# EAGLE design photon_rj45 (EAGLE 8.5.0)
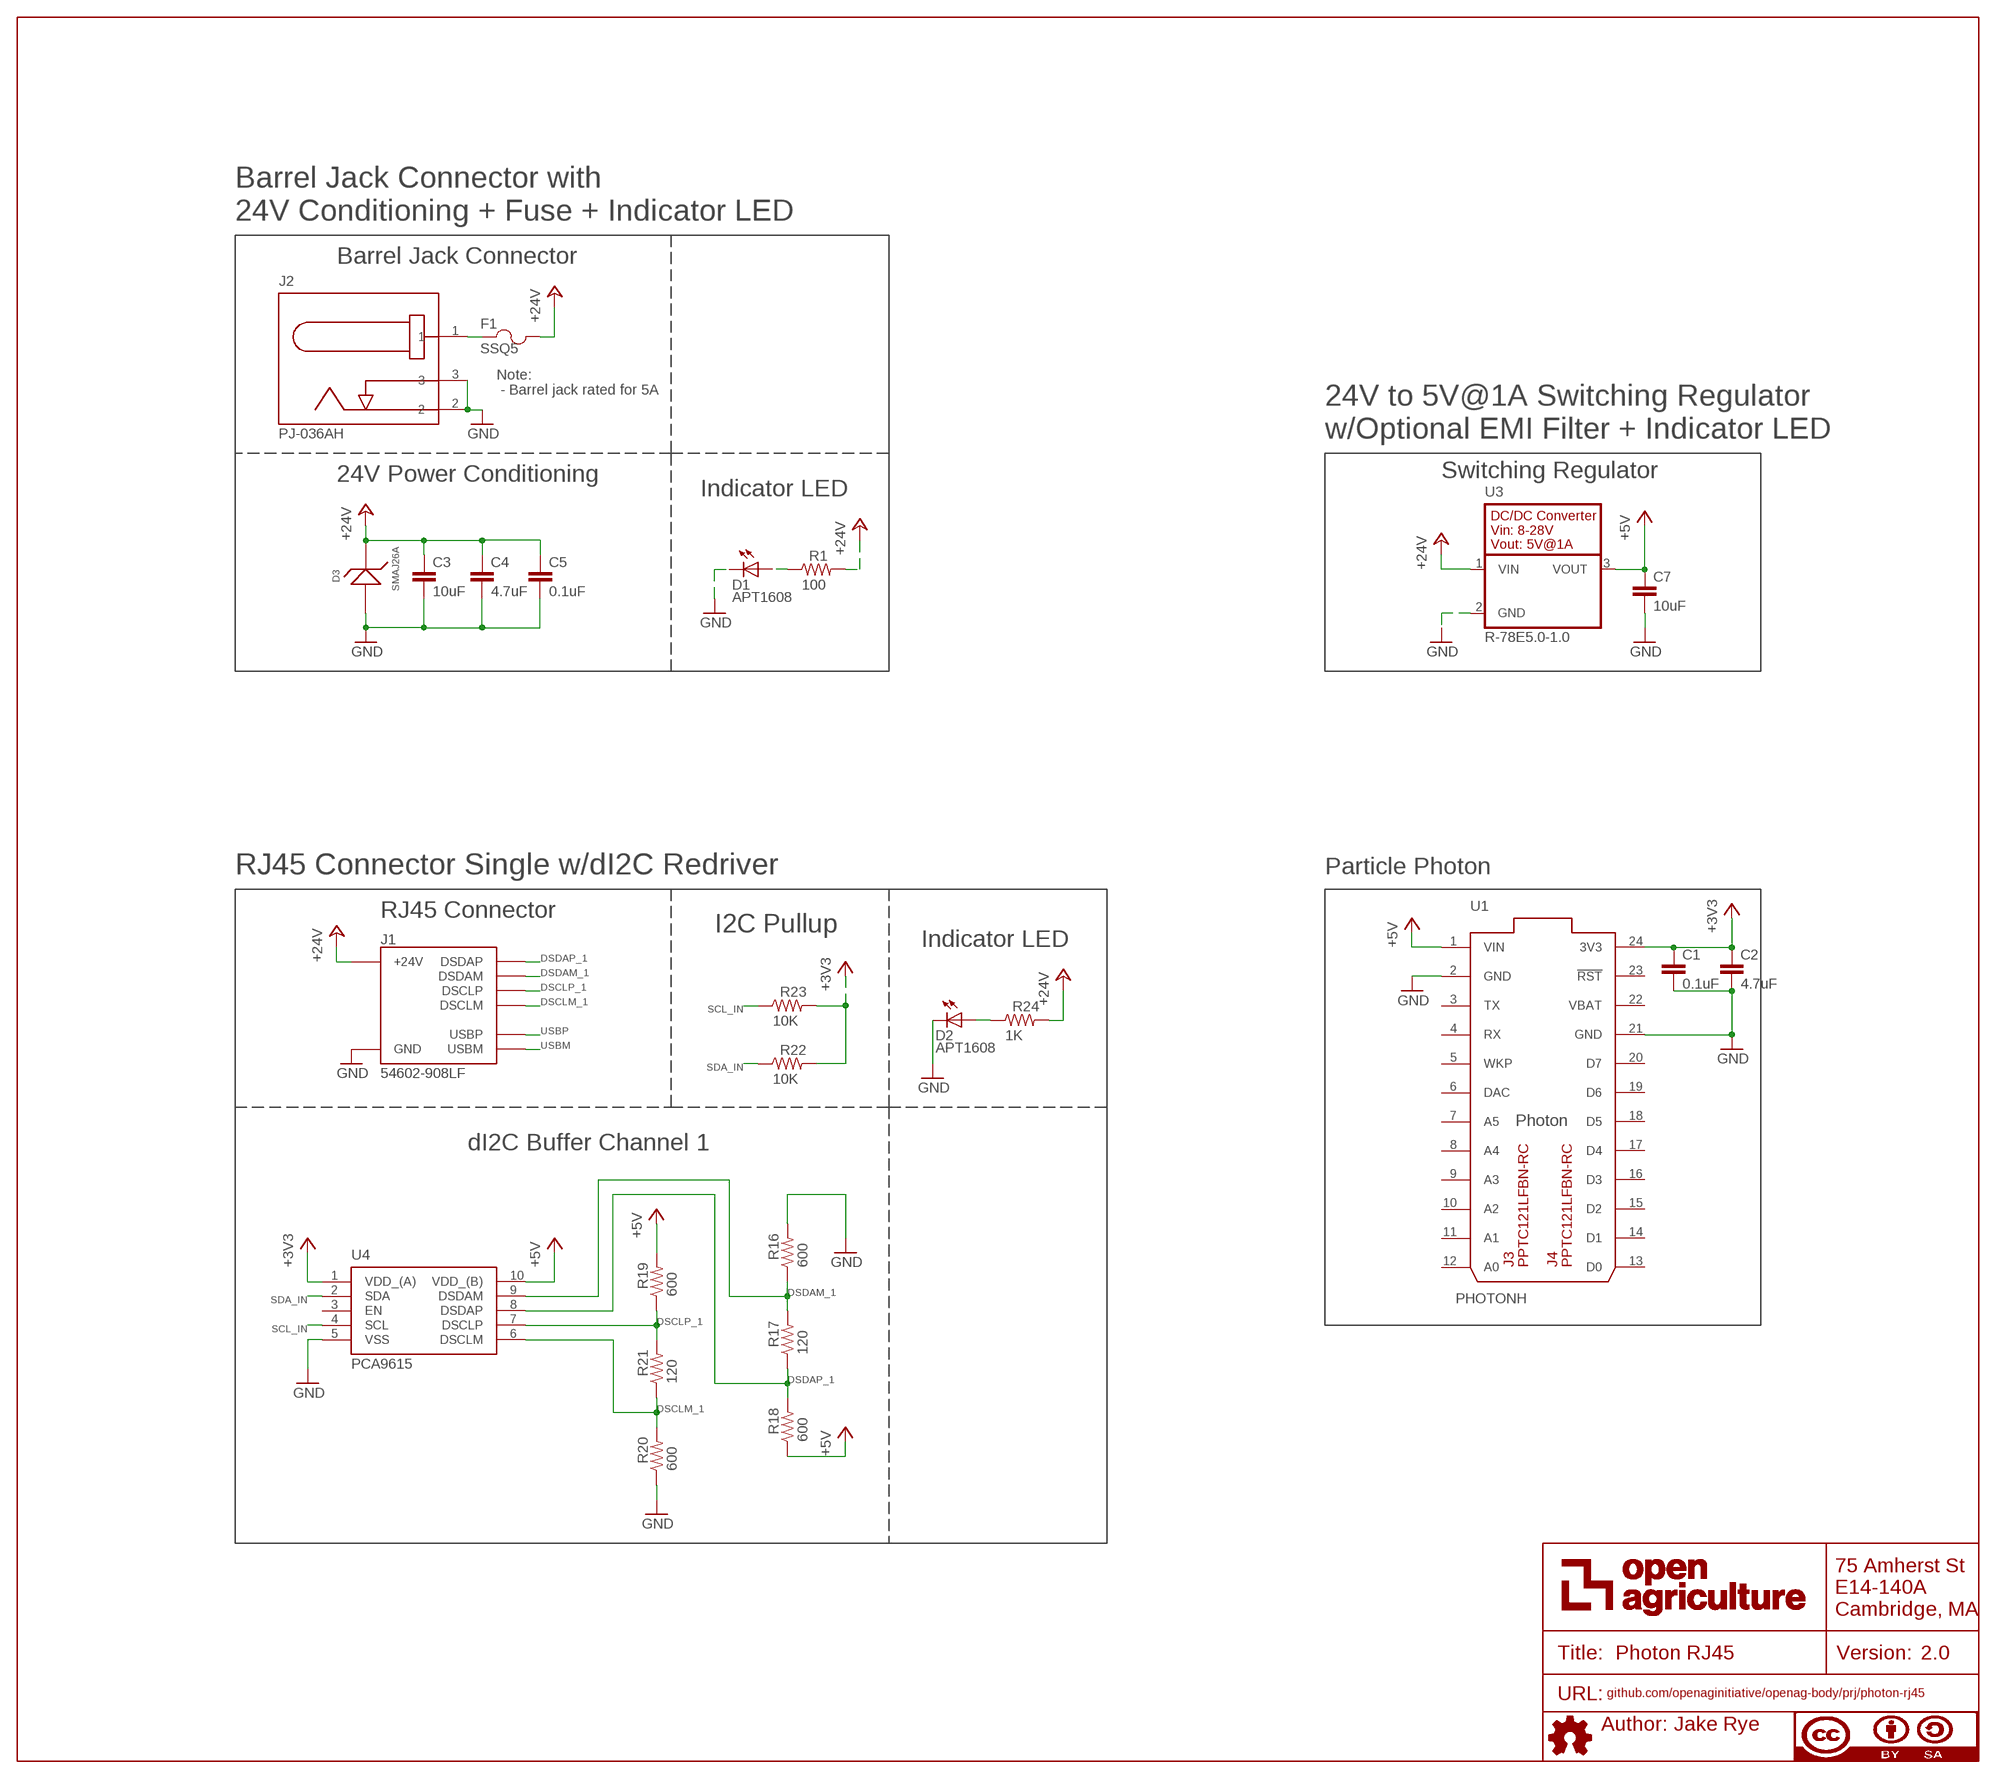
[diagram p0: schematic, sheet 1]
U$2 (DOCFIELD-SCHEMATIC-ONLY): AUTHOR: Jake Rye; MPN: N/A; TITLE: Photon RJ45; URL: github.com/openaginitiative/openag-body/prj/photon-rj45; VER: 2.0

## Parts
C1  0.1uF  0.1UF-C0603C104K5RACTU  [C0603]
C2  4.7uF  4.7UF-CL21A475KBQNNNE  [C0805]
C3  10uF  10UF-GMK212BBJ106KG-T  [C0805]
C4  4.7uF  4.7UF-CL21A475KBQNNNE  [C0805]
C5  0.1uF  0.1UF-C0603C104K5RACTU  [C0603]
C7  10uF  10UF-GMK212BBJ106KG-T  [C0805]
D1  APT1608  APT1608CGCK  [CHIPLED_0603]
D2  APT1608  APT1608CGCK  [CHIPLED_0603]
D3  SMAJ26A  SMAJ26A-13-F  [SMA]
F1  SSQ5  [SS]
J1  54602-908LF  RJ45-DI2C-USB-54602-908LFPTH  [RJ45-DI2C-USB-54602-908LF]
J2  PJ-036AH  BARREL-JACK-PJ-036AH-SMT-TR  [BARREL-JACK-PJ-036AH]
J3  PPTC121LFBN-RC  HEADER-1X12-FEMALE-PPTC121LFBN-RC-BOM-ONLY  [NAME-VALUE-ONLY]
J4  PPTC121LFBN-RC  HEADER-1X12-FEMALE-PPTC121LFBN-RC-BOM-ONLY  [NAME-VALUE-ONLY]
R1  100  100OHM-RC0603JR-07100RL  [RC0603N]
R16  600  600OHM-RC0603FR-07604RL  [RC0603N]
R17  120  120OHM-RC0603FR-07120RL  [RC0603N]
R18  600  600OHM-RC0603FR-07604RL  [RC0603N]
R19  600  600OHM-RC0603FR-07604RL  [RC0603N]
R20  600  600OHM-RC0603FR-07604RL  [RC0603N]
R21  120  120OHM-RC0603FR-07120RL  [RC0603N]
R22  10K  10K-ERJ-3EKF1002V  [RC0603N]
R23  10K  10K-ERJ-3EKF1002V  [RC0603N]
R24  1K  1K-ERJ-PB3D1001V  [RC0603N]
U1  PHOTONH  PHOTONH-NO-BOTTOM-LABEL  [PHOTON-NO-BOTTOM-LABELS]
U3  R-78E5.0-1.0  [R-78E5.0-1.0]
U4  PCA9615  PCA9615DPJ  [SOP50P490X110-10N]

## Nets
24V_IN1: F1.1 J2.1
+3V3: C1.1 C2.1 R22.2 R23.2 U1.24(3V3) U4.1(VDD_(A))
+5V: C7.1 R18.1 R19.2 U1.1(VIN) U3.3(VOUT) U4.10(VDD_(B))
+24V: C3.1 C4.1 C5.1 D3.1 F1.2 J1.24V(6)(+24V) R1.2 R24.2 U3.1(VIN)
DSCLM_1: J1.DSCLM(5)(DSCLM) R20.2 R21.1 U4.6(DSCLM)
DSCLP_1: J1.DSCLP(4)(DSCLP) R19.1 R21.2 U4.7(DSCLP)
DSDAM_1: J1.DSDAM(2)(DSDAM) R16.1 R17.2 U4.9(DSDAM)
DSDAP_1: J1.DSDAP(1)(DSDAP) R17.1 R18.2 U4.8(DSDAP)
GND: C1.2 C2.2 C3.2 C4.2 C5.2 C7.2 D1.C D2.C D3.2 J1.GND(3)(GND) J2.2 J2.3 R16.2 R20.1 U1.2(GND) U1.21(GND) U3.2(GND) U4.5(VSS)
N$5: D2.A R24.1
N$6: D1.A R1.1
SCL_IN: R23.1 U4.4(SCL)
SDA_IN: R22.1 U4.2(SDA)
USBM: J1.USBM(8)(USBM)
USBP: J1.USBP(7)(USBP)
Unconnected: U1.3(TX) U1.4(RX) U1.5(WKP) U1.6(DAC) U1.7(A5) U1.8(A4) U1.9(A3) U1.10(A2) U1.11(A1) U1.12(A0) U1.13(D0) U1.14(D1) U1.15(D2) U1.16(D3) U1.17(D4) U1.18(D5) U1.19(D6) U1.20(D7) U1.23(!RST) U4.3(EN)

## Notes on the sheet
- Barrel Jack Connector with
  24V Conditioning + Fuse + Indicator LED
- Barrel Jack Connector
- Note:
   - Barrel jack rated for 5A
- 24V to 5V@1A Switching Regulator
  w/Optional EMI Filter + Indicator LED
- 24V Power Conditioning | Switching Regulator
- Indicator LED
- RJ45 Connector Single w/dI2C Redriver | Particle Photon
- RJ45 Connector
- I2C Pullup
- Indicator LED
- dI2C Buffer Channel 1

## Power pins joined to a net without a drawn wire
VBAT: U1.22(VBAT)

## Library data of the parts
C1 C5 = openag-capacitors:0.1UF-C0603C104K5RACTU: CAP CER 0.1UF 50V X7R 0603 Description: 0.1µF ±10% 50V Ceramic Capacitor X7R 0603 (1608 Metric) Technical Specifications: Capacitance: 0.1µF Tolerance: ±10% Rated Voltage: 50V Temperature Coefficient: X7R Operating Temperature: -55°C ~ 125°C Package / Case: 0603 (1608 Metric) Datasheet(s): X7R Dielectric, 6.3-250 VDC <https://search.kemet.com/component-edge/download/datasheet/C0603C104K5RACTU.pdf> Vendor(s): Digikey: 399-5089-1-ND <https://www.digikey.com/product-detail/en/kemet/C0603C104K5RACTU/399-5089-1-ND/1465623>; MANUFACTURER: Kemet; MPN: C0603C104K5RACTU; VENDOR: Digikey; VLINK: https://www.digikey.com/product-detail/en/kemet/C0603C104K5RACTU/399-5089-1-ND/1465623; VPN: 399-5089-1-ND
C2 C4 = openag-capacitors:4.7UF-CL21A475KBQNNNE: CAP CER 4.7UF 50V X5R 0805 Description: 4.7µF ±10% 50V Ceramic Capacitor X5R 0805 (2012 Metric) Technical Specifications: Capacitance: 4.7uF Tolerance: ±10% Rated Voltage: 50V Temperature Coefficient: X5R Operating Temperature: -55°C ~ 85°C Package/Case: 0805 (2012 Metric) Datasheet(s): CL21A475KBQNNNE Characteristics <http://www.samsungsem.com/kr/front/downloadcms.do?path=/kr/support/product-search/mlcc/__icsFiles/afieldfile/2014/11/05&fileName=C_CL21A475KBQNNNE.pdf> Vendor(s): Digikey: 1276-1248-1-ND <https://www.digikey.com/product-detail/en/samsung-electro-mechanics/CL21A475KBQNNNE/1276-1248-1-ND/3889334>; MANUFACTURER: Samsung; MPN: CL21A475KBQNNNE; VENDOR: Digikey; VLINK: https://www.digikey.com/product-detail/en/samsung-electro-mechanics/CL21A475KBQNNNE/1276-1248-1-ND/3889334; VPN: 1276-1248-1-ND
C3 C7 = openag-capacitors:10UF-GMK212BBJ106KG-T: CAP CER 10UF 35V X5R 0805 Description: 10µF ±10% 35V Ceramic Capacitor X5R 0805 (2012 Metric) Technical Specifications: Capacitance: 10µF Tolerance: ±10% Rated Voltage: 35V Temperature Coefficient: X5R Operating Temperature: -55°C ~ 85°C Package / Case: 0805 (2012 Metric) Datasheet(s): GMK212BBJ106KG-T Spec <http://ds.yuden.co.jp/TYCOMPAS/ut/detail.do?productNo=GMK212BBJ106KG-T&fileName=GMK212BBJ106KG-T_SS&mode=specSheetDownload> Vendor(s): Digikey: 587-4893-1-ND <https://www.digikey.com/product-detail/en/taiyo-yuden/GMK212BBJ106KG-T/587-4893-1-ND/6563736>; MANUFACTURER: Taiyo Yuden; MPN: GMK212BBJ106KG-T; VENDOR: Digikey; VLINK: https://www.digikey.com/product-detail/en/taiyo-yuden/GMK212BBJ106KG-T/587-4893-1-ND/6563736; VPN: 587-4893-1-ND
D1 D2 = openag-diodes:APT1608CGCK: LED GREEN CLEAR 0603 SMD Description: Green 570nm LED Indication - Discrete 2.1V 0603 (1608 Metric) Technical Specifications: Color: Green Lens Color: Colorless Lens Transparency: Clear Millicandela Rating: 50mcd Lens Style/Size: Rectangle with Flat Top, 1.20mm x 0.80mm Voltage - Forward (Vf) (Typ): 2.1V Current - Test: 20mA Viewing Angle: 120° Mounting Type: Surface Mount Wavelength - Dominant: 570nm Wavelength - Peak: 574nm Package / Case: 0603 (1608 Metric) Supplier Device Package: Chip LED Size / Dimension: 1.60mm L x 0.80mm W Height (Max): 0.75mm Datasheet(s): APT1608CGCK <http://www.kingbrightusa.com/images/catalog/SPEC/APT1608CGCK.pdf> Vendor(s): Digikey: 754-1116-1-ND <https://www.digikey.com/product-detail/en/kingbright/APT1608CGCK/754-1116-1-ND/1747833#>; MANUFACTURER: Kingbright; MPN: APT1608CGCK; VENDOR: Digikey; VLINK: https://www.digikey.com/product-detail/en/kingbright/APT1608CGCK/754-1116-1-ND/1747833#; VPN: 754-1116-1-ND
D3 = openag-diodes:SMAJ26A-13-F: TVS DIODE 26VWM 42.1VC SMA Description: TVS DIODE 26VWM 42.1VC SMA Technical Specifications: Type: Zener Voltage - Reverse Standoff (Typ): 26V Voltage - Breakdown (Min): 28.9V Voltage - Clamping (Max) @ Ipp: 42.1V Current - Peak Pulse (10/1000µs): 9.5A Power - Peak Pulse: 400W Power Line Protection: No Operating Temperature: -55°C ~ 150°C (TJ) DO-214AC, SMA Datasheet(s): SMAJ5.0(C)A - SMAJ200(C)A Vendor(s): Digikey: SMAJ26A-FDICT-ND <https://www.digikey.com/product-detail/en/diodes-incorporated/SMAJ26A-13-F/SMAJ26A-FDICT-ND/806583>; MANUFACTURER: Diodes Incorporated; MPN: SMAJ26A-13-F; VENDOR: Digikey; VLINK: https://www.digikey.com/product-detail/en/diodes-incorporated/SMAJ26A-13-F/SMAJ26A-FDICT-ND/806583; VPN: SMAJ26A-FDICT-ND
F1 = openag-fuses:SSQ5: FUSE BRD MNT 5A 125VAC/VDC 2SMD Description: FUSE BRD MNT 3A 125VAC/VDC 2SMD Technical Specifications: Fuse Type: Board Mount (Cartridge Style Excluded) Current Rating: 5A Voltage Rating - AC: 125V Voltage Rating - DC: 125V Response Time: Fast Package / Case: 2-SMD, Square End Block Mounting Type: Surface Mount Breaking Capacity @ Rated Voltage: 50A AC, 300A DC Melting I²t: 8.8 Approvals: CE, CSA, cULus Operating Temperature: -55°C ~ 125°C Size / Dimension: 0.240" L x 0.100" W x 0.100" H (6.10mm x 2.54mm x 2.54mm) DC Cold Resistance: 0.013 Ohms Datasheet(s): SSQ Type <https://belfuse.com/resources/StewartConnector/SSQ.pdf> Vendor(s): Digikey: 507-1053-1-ND <https://www.digikey.com/product-detail/en/bel-fuse-inc/SSQ-5/507-1053-1-ND/615005>; MANUFACTURER: Bel Fuse Inc.; MPN: SSQ5; VENDOR: Digikey; VLINK: https://www.digikey.com/product-detail/en/bel-fuse-inc/SSQ-5/507-1053-1-ND/615005; VPN: 507-1053-1-ND
J1 = openag-connectors:RJ45-DI2C-USB-54602-908LF: CONN MOD JACK 8P8C R/A UNSHLD Description: Jack Modular Connector 8p8c (RJ45, Ethernet) 90° Angle (Right) Unshielded Cat3 Technical Specifications: Connector Type: Jack Number of Positions/Contacts: 8p8c (RJ45, Ethernet) Number of Ports: 1 Number of Rows: 1 Mounting Type: Through Hole Orientation: 90° Angle (Right) Termination: Solder Shielding: Unshielded Ratings: Cat3 Features: Board Lock LED Color: Does Not Contain LED Tab Direction: Down Contact Material: Copper Alloy Contact Finish: Gold Contact Finish Thickness: 15µin (0.38µm) Housing Material: Polyester, Glass Filled Operating Temperature: -40°C ~ 70°C Datasheet(s): 54601-x04(zzz)WPLF Drawing <http://cdn.amphenol-icc.com/media/wysiwyg/files/drawing/c-bmj-0102.pdf> Vendor(s): Digikey: 609-1046-ND <https://www.digikey.com/product-detail/en/amphenol-fci/54602-908LF/609-1046-ND/1001360>; MANUFACTURER: Amphenol FCI; MPN: 54602-908LF; VENDOR: Digikey; VLINK: https://www.digikey.com/product-detail/en/amphenol-fci/54602-908LF/609-1046-ND/1001360; VPN: 609-1046-ND
J2 = openag-connectors:BARREL-JACK-PJ-036AH-SMT-TR: CONN PWR JACK 2X5.5MM SOLDER Description: Power Barrel Connector Jack 2.10mm ID (0.083"), 5.50mm OD (0.217") Surface Mount, Right Angle Technical Specifications: Connector Type: Jack Gender: Male Industry Recognized Mating Diameter: 2.10mm ID (0.083"), 5.50mm OD (0.217") Actual Diameter: 0.078" (2.00mm ID), 0.248" (6.30mm OD) Number of Positions/Contacts: 2 Conductors, 3 Contacts Internal Switch(s): Single Switch, Normally Closed Mounting Type: Surface Mount, Right Angle Termination: Solder Shielding: Unshielded Voltage - Rated: 24VDC Current Rating: 5A Mating Length/Depth: 0.360" (9.15mm) Contact Material - Plating: Silver Operating Temperature: -25°C ~ 85°C Housing Material: Polyamide (PA6T), Nylon 6T Contact Material: Brass; Copper Alloy Body Color: Black Datasheet(s): PJ-036AH-SMT-TR <http://www.cui.com/product/resource/digikeypdf/pj-036ah-smt-tr.pdf> Vendor(s): Digikey: CP-036AHPJCT-ND <https://www.digikey.com/product-detail/en/cui-inc/PJ-036AH-SMT-TR/CP-036AHPJCT-ND/1530994>; MANUFACTURER: CUI Inc.; MPN: PJ-036AH-SMT-TR; VENDOR: Digikey; VLINK: https://www.digikey.com/product-detail/en/cui-inc/PJ-036AH-SMT-TR/CP-036AHPJCT-ND/1530994; VPN: CP-036AHPJCT-ND
J3 J4 = openag-connectors:HEADER-1X12-FEMALE-PPTC121LFBN-RC-BOM-ONLY: CONN HEADER FEM 12POS.1" SGL TIN Description: 12 Position Header Connector 0.100" (2.54mm) Through Hole Tin Technical Specifications: Connector Type: Header Contact Type: Female Socket Style: Board to Board Number of Positions: 12 Number of Positions Loaded: All Pitch - Mating: 0.100" (2.54mm) Number of Rows: 1 Mounting Type: Through Hole Termination: Solder Fastening Type: Push-Pull Contact Finish - Mating: Tin Insulation Color: Black Insulation Height: 0.335" (8.51mm) Contact Length - Post: 0.126" (3.20mm) Operating Temperature: -40°C ~ 105°C Material Flammability Rating: UL94 V-0 Contact Finish - Post: Tin Current Rating: 3A Voltage Rating: 250V Insulation Material: Polyester Contact Shape: Square Contact Material: Phosphor Bronze Datasheet(s): xPxCyyyLFBN-RC Drawing <http://www.sullinscorp.com/drawings/78_P(N)PxCxxxLFBN-RC,_10492-H.pdf> Female Headers .100" Data Sheet <http://sullinscorp.com/catalogs/101_PAGE114-115_.100_FEMALE_HDR.pdf> Vendor(s): Digikey: S6100-ND <https://www.digikey.com/product-detail/en/sullins-connector-solutions/PPTC121LFBN-RC/S6100-ND/807231>; MANUFACTURER: Sullins Connector Solutions; MPN: PPTC121LFBN-RC; VENDOR: Digikey; VLINK: https://www.digikey.com/product-detail/en/sullins-connector-solutions/PPTC121LFBN-RC/S6100-ND/807231#; VPN: S6100-ND
R1 = openag-resistors:100OHM-RC0603JR-07100RL: RES SMD 100 OHM 5% 1/10W 0603 Description: 100 Ohms ±5% 0.1W, 1/10W Chip Resistor 0603 (1608 Metric) Moisture Resistant Thick Film Technical Specifications: Resistance: 100 Ohms Tolerance: ±5% Power (Watts): 0.1W, 1/10W Composition: Thick Film Features: Moisture Resistant Temperature Coefficient: ±100ppm/°C Operating Temperature: -55°C ~ 155°C Package / Case: 0603 (1608 Metric) Supplier Device Package: 0603 Size / Dimension: 0.063" L x 0.032" W (1.60mm x 0.80mm) Height - Seated (Max): 0.022" (0.55mm) Number of Terminations: 2 Datasheet(s): Thick Film Chip Resistor Intro <http://www.yageo.com.tw/exep/pages/download/literatures/PYu-R_INT-thick_7.pdf> Chip Resistor Marking <http://www.yageo.com/exep/pages/download/literatures/PYu-R_Marking_2.pdf> RC Series, L Datasheet <http://www.yageo.com/documents/recent/PYu-RC_Group_51_RoHS_L_8.pdf> Vendor(s): Digikey: 311-100GRCT-ND <https://www.digikey.com/product-detail/en/yageo/RC0603JR-07100RL/311-100GRCT-ND/729644>; MANUFACTURER: Yageo; MPN: RC0603JR-07100RL; VENDOR: Digikey; VLINK: https://www.digikey.com/product-detail/en/yageo/RC0603JR-07100RL/311-100GRCT-ND/729644; VPN: 311-100GRCT-ND
R16 R18-R20 = openag-resistors:600OHM-RC0603FR-07604RL: RES SMD 604 OHM 1% 1/10W 0603 Description: 604 Ohms ±1% 0.1W, 1/10W Chip Resistor 0603 (1608 Metric) Moisture Resistant Thick Film Technical Specifications: Resistance: 604 Ohms Tolerance: ±1% Power (Watts): 0.1W, 1/10W Composition: Thick Film Features: Moisture Resistant Temperature Coefficient: ±100ppm/°C Operating Temperature: -55°C ~ 155°C Package / Case: 0603 (1608 Metric) Supplier Device Package: 0603 Size / Dimension: 0.063" L x 0.032" W (1.60mm x 0.80mm) Height - Seated (Max): 0.022" (0.55mm) Number of Terminations: 2 Datasheet(s): RC Series, L Datasheet <http://www.yageo.com/documents/recent/PYu-RC_Group_51_RoHS_L_8.pdf> Chip Resistor Marking <http://www.yageo.com/exep/pages/download/literatures/PYu-R_Marking_2.pdf> Vendor(s): Digikey: 311-604HRCT-ND <https://www.digikey.com/product-detail/en/yageo/RC0603FR-07604RL/311-604HRCT-ND/730276>; MANUFACTURER: Yageo; MPN: RC0603FR-07604RL; VENDOR: Digikey; VLINK: https://www.digikey.com/product-detail/en/yageo/RC0603FR-07604RL/311-604HRCT-ND/730276; VPN: 311-604HRCT-ND
R17 R21 = openag-resistors:120OHM-RC0603FR-07120RL: RES SMD 120 OHM 1% 1/10W 0603 Description: 120 Ohms ±1% 0.1W, 1/10W Chip Resistor 0603 (1608 Metric) Moisture Resistant Thick Film Technical Specifications: Resistance: 120 Ohms Tolerance: ±1% Power (Watts): 0.1W, 1/10W Composition: Thick Film Features: Moisture Resistant Temperature Coefficient: ±100ppm/°C Operating Temperature: -55°C ~ 155°C Package / Case: 0603 (1608 Metric) Supplier Device Package: 0603 Size / Dimension: 0.063" L x 0.032" W (1.60mm x 0.80mm) Height - Seated (Max): 0.022" (0.55mm) Number of Terminations: 2 Datasheet(s): RC Series, L Datasheet <http://www.yageo.com/documents/recent/PYu-RC_Group_51_RoHS_L_8.pdf> Chip Resistor Marking <http://www.yageo.com/exep/pages/download/literatures/PYu-R_Marking_2.pdf> Vendor(s): Digikey: 311-120HRCT-ND <https://www.digikey.com/product-detail/en/yageo/RC0603FR-07120RL/311-120HRCT-ND/729867>; MANUFACTURER: Yageo; MPN: RC0603FR-07120RL; VENDOR: Digikey; VLINK: https://www.digikey.com/product-detail/en/yageo/RC0603FR-07120RL/311-120HRCT-ND/729867; VPN: 311-120HRCT-ND
R22 R23 = openag-resistors:10K-ERJ-3EKF1002V: RES SMD 10K OHM 1% 1/10W 0603 Description: 10 kOhms ±1% 0.1W, 1/10W Chip Resistor 0603 (1608 Metric) Automotive AEC-Q200 Thick Film Technical Specifications: Resistance: 10kOhms Tolerance: ±1% Power: 0.1W, 1/10W Operating Temperature: -55°C ~ 155°C Package/Case: 0603 (1608 Metric) Datasheet(s): ERJ-3EKF1002V View All Specifications <https://industrial.panasonic.com/ww/products/resistors/chip-resistors/general-purpose-chip-resistors/precision-thick-film-chip-resistors/ERJ3EKF1002V> Vendor(s): Digikey: P10.0KHCT-ND <https://www.digikey.com/product-detail/en/panasonic-electronic-components/ERJ-3EKF1002V/P10.0KHCT-ND/198102>; MANUFACTURER: Panasonic; MPN: ERJ-3EKF1002V; VENDOR: Digikey; VLINK: https://www.digikey.com/product-detail/en/panasonic-electronic-components/ERJ-3EKF1002V/P10.0KHCT-ND/198102; VPN: P10.0KHCT-ND
R24 = openag-resistors:1K-ERJ-PB3D1001V: RES SMD 1K OHM 0.5% 1/5W 0603 Description: 1 kOhms ±0.5% 0.2W, 1/5W Chip Resistor 0603 (1608 Metric) Automotive AEC-Q200, Pulse Withstanding Thick Film Technical Specifications: Resistance: 1 kOhms Tolerance: ±0.5% Power: 0.2W, 1/5W Operating Temperature: -55°C ~ 155°C Package / Case: 0603 (1608 Metric) Datasheet(s): ERJ-PB3, PB6 Series, High Precision Datasheet <https://industrial.panasonic.com/cdbs/www-data/pdf/RDM0000/AOA0000C328.pdf> Vendor(s): Digikey: P20283CT-ND <https://www.digikey.com/product-detail/en/panasonic-electronic-components/ERJ-PB3D1001V/P20283CT-ND/6214538>; MANUFACTURER: Panasonic; MPN: P20283CT-ND; VENDOR: Digikey; VLINK: https://www.digikey.com/product-detail/en/panasonic-electronic-components/ERJ-PB3D1001V/P20283CT-ND/6214538; VPN: P20283CT-ND
U1 = openag-microcontrollers:PHOTONH: Tiny Wi-Fi dev board w/cloud backend Description: The Photon is a $19 tiny Wi-Fi development kit for creating connected projects and products for the Internet of Things. It's easy to use, it's powerful, and it's connected to the cloud. Technical Specifications: Processor: STM32F205RGY6 120Mhz ARM Cortex M3 Wireless: 802.11b/g/n Wi-Fi Peripherals: Digital(x18), ADC(x8), DAC(x2), SPI(x2), I2S(x1), I2C(x1) SPI, CAN(1), USB(1), PWM(9) Memory: 1MB flash, 128KB RAM Cerfifications: FCC, CE and IC Operating Temperature: -20°C ~ 60°C Humidity Range: Non condensing, relative humidity: 95% Supply Input Voltage (VIN): 3.6V ~ 5.5V Supply Input Voltage (3V3): 3.0V ~ 3.6V Max Supply Output Current (VIN): 1A Max Supply Output Current (3V3): 100mA Average Operating Current (WiFi on, @VIN): up to 100mA Peak Operating Current (WiFi on, @VIN): up to 430mA I/O Max Source/Sink Current (Individual): 25mA I/O Max Source/Sinnk Current (Total): 120mA Datasheet(s): Photon Datasheet <https://docs.particle.io/datasheets/photon-datasheet/> Vendor(s): Particle: PHOTONH <https://store.particle.io/products/photon>; MANUFACTURER: Particle; MPN: PHOTONH; VENDOR: Particle; VLINK: https://store.particle.io/products/photon; VPN: Particle
U3 = openag-regulators:R-78E5.0-1.0: DC/DC CONVERTER 5V 5W Description: Linear Regulator Replacement DC DC Converter 1 Output 5V 1A 8V - 28V Input Technical Specifications: Type: Linear Regulator Replacement Number of Outputs: 1 Voltage - Input (Min): 8V Voltage - Input (Max): 28V Voltage - Output 1: 5V Current - Output (Max): 1A Power (Watts): 5W Applications: ITE (Commercial) Features: SCP Operating Temperature: -40°C ~ 85°C Efficiency: 91% Mounting Type: Through Hole Package / Case: 3-SIP Module Size / Dimension: 0.46" L x 0.33" W x 0.41" H (11.6mm x 8.5mm x 10.4mm) Datasheet(s): R-78E-1.0 Series Datasheet <https://www.recom-power.com/pdf/Innoline/R-78Exx-1.0.pdf> Vendor(s): Digikey: 945-2201-ND <https://www.digikey.com/product-detail/en/recom-power/R-78E5.0-1.0/945-2201-ND/4930585>; MANUFACTURER: Recom Power; MPN: R-78E5.0-1.0; VENDOR: Digikey; VLINK: https://www.digikey.com/product-detail/en/recom-power/R-78E5.0-1.0/945-2201-ND/4930585; VPN: 945-2201-ND
U4 = openag-buffers:PCA9615DPJ: IC REDRIVER I2C 2CH 10TSSOP Description: Buffer, ReDriver 2 Channel 400kHz 10-TSSOP Technical Specifications: Type: Buffer, ReDriver Applications: I²C Input: 2-Wire Bus Output: 2-Wire Bus Data Rate (Max): 400kHz Number of Channels: 2 Capacitance - Input: 7pF Voltage - Supply: 2.3 V ~ 5.5 V Current - Supply: 16µA Operating Temperature: -40°C ~ 85°C Package / Case: 10-TFSOP, 10-MSOP (0.118", 3.00mm Width) Supplier Device Package: 10-TSSOP Base Part Number: PCA9615 Datasheet(s): PCA9615DP <http://www.nxp.com/documents/data_sheet/PCA9615.pdf> Vendor(s): Digikey: 568-11484-1-ND <https://www.digikey.com/product-detail/en/nxp-usa-inc/PCA9615DPJ/568-11484-1-ND/4864508>; MANUFACTURER: NXP USA Inc.; MPN: PCA9615DPJ; VENDOR: Digikey; VLINK: https://www.digikey.com/product-detail/en/nxp-usa-inc/PCA9615DPJ/568-11484-1-ND/4864508; VPN: 568-11484-1-ND

## Board
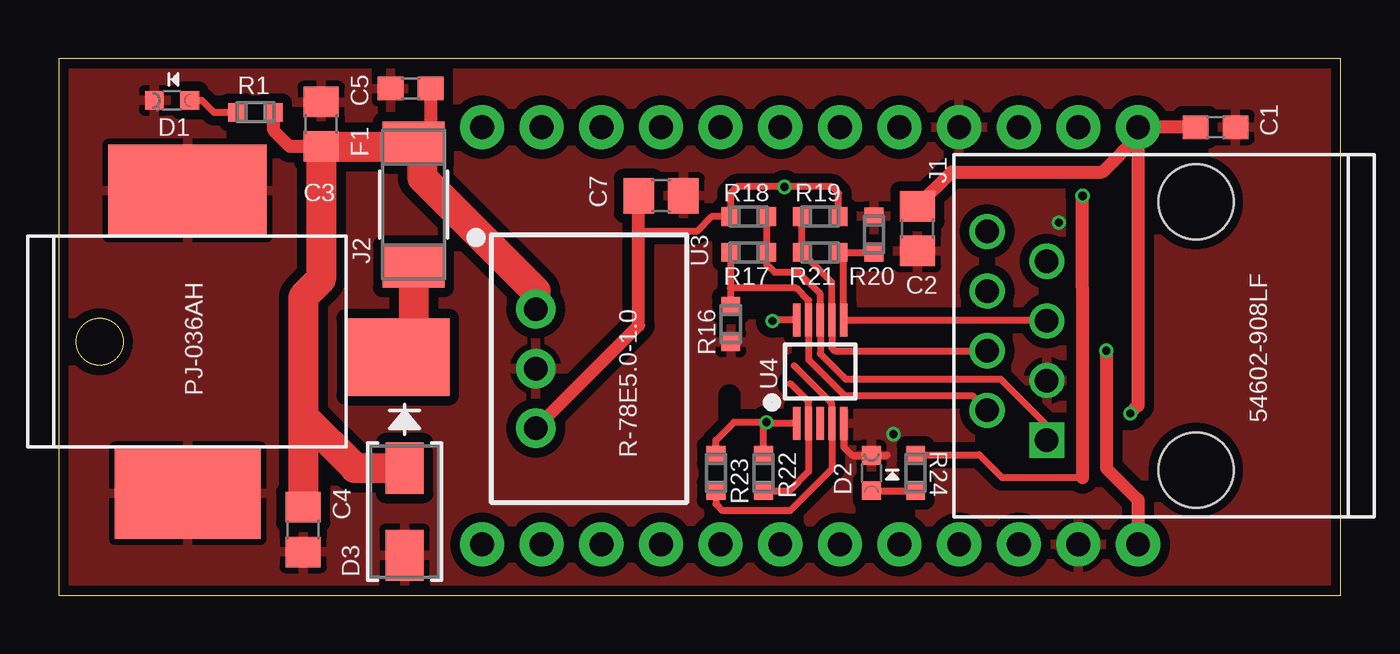
[diagram p1: board, top side]
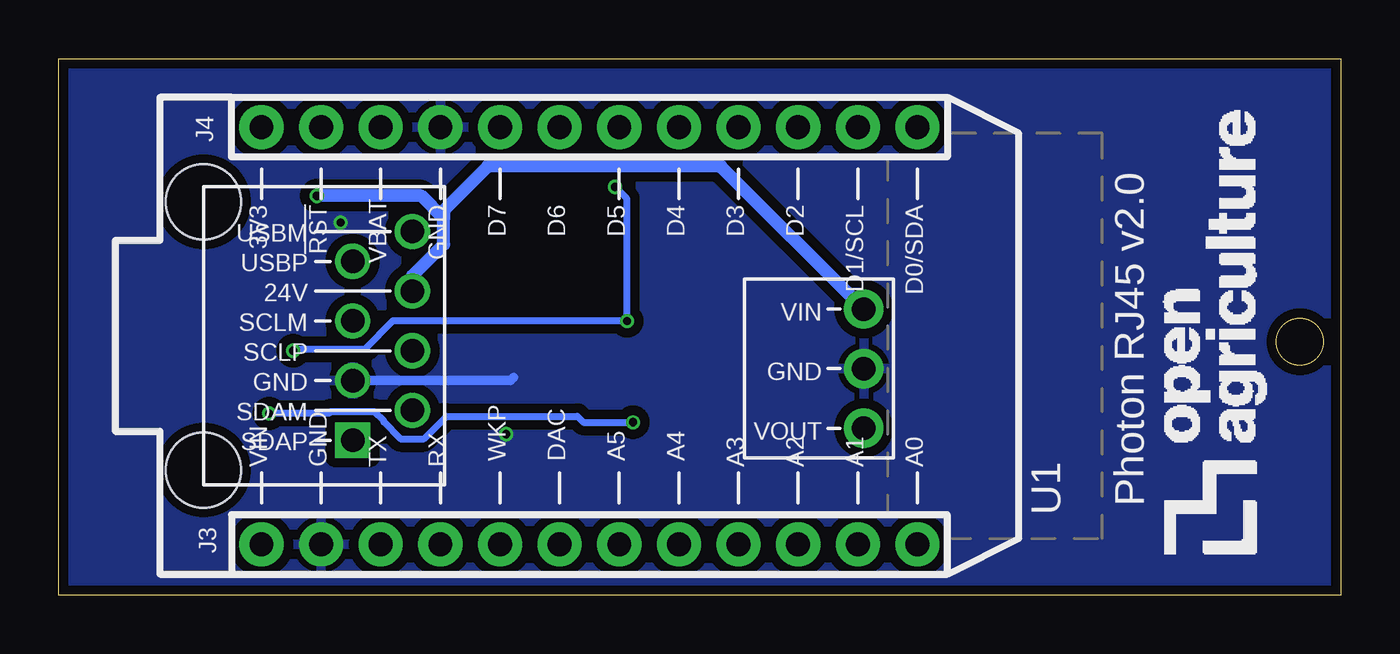
[diagram p2: board, bottom side, seen from below]

Size 54.61 x 22.86 mm. Coordinates in mm from the lower left corner, seen from the top.
Outline: 0,0 54.61,0 54.61,22.86 0,22.86 0,0
Copper layers (1*16): Top 0.035559375mm / dielectric 1.6mm / Bottom 0.035559375mm
Design rules "oshpark-2layer-mask": minimum track width 6mil, minimum drill 10mil, track to track 6mil, track to pad 6mil, pad to pad 6mil, via to via 6mil, smd to smd 6mil, copper to edge 15mil, drill to drill 6mil, minimum pad ring 5mil, minimum via ring 5mil, stop-mask expansion 2.5mil, vias tented up to drill 20mil, thermal gap 10mil
tRestrict: 1 lines

### Footprints (pad centres in the part's own frame; a part is rotated, then mirrored left to right if it is on the bottom)
C0603 = smd 1.1 x 1: 1 -0.85,0; 2 0.85,0
C0805 = smd 1.3 x 1.5: 1 -0.95,0; 2 0.95,0
CHIPLED_0603 = smd 0.8 x 0.8: A 0,-0.75; C 0,0.75
SMA = smd 2.18 x 1.63: 1 -1.857,0; 2 1.857,0
SS = smd 1.803 x 2.642: 1 -2.629,0; 2 2.629,0
RJ45-DI2C-USB-54602-908LF = drill 1: 24V(6) 1.905,8.89; DSCLM(5) 0.635,6.35; DSCLP(4) -0.635,8.89; DSDAM(2) -3.175,8.89; GND(3) -1.905,6.35; USBM(8) 4.445,8.89; USBP(7) 3.175,6.35 | drill 1 square: DSDAP(1) -4.445,6.35 | hole 3.2: -5.715,0; 5.715,0
BARREL-JACK-PJ-036AH = smd 4.4 x 3.3: 1 2.2,-0.65 | smd 6.75 x 3.9: 2 -6.75,6.45 | smd 6.2 x 3.9: 3 -6.75,-6.45
RC0603N = smd 0.756 x 0.8: 1 -0.778,0; 2 0.778,0
PHOTON-NO-BOTTOM-LABELS = drill 1.016 pad 1.88: 1 1.27,32.258; 2 1.27,29.718; 3 1.27,27.178; 4 1.27,24.638; 5 1.27,22.098; 6 1.27,19.558; 7 1.27,17.018; 8 1.27,14.478; 9 1.27,11.938; 10 1.27,9.398; 11 1.27,6.858; 12 1.27,4.318; 13 19.05,4.318; 14 19.05,6.858; 15 19.05,9.398; 16 19.05,11.938; 17 19.05,14.478; 18 19.05,17.018; 19 19.05,19.558; 20 19.05,22.098; 21 19.05,24.638; 22 19.05,27.178; 23 19.05,29.718; 24 19.05,32.258
R-78E5.0-1.0 = drill 1 pad 1.676: 1 -2.54,0; 2 0,0; 3 2.54,0
SOP50P490X110-10N = smd 1.4 x 0.3: 1 -2.2,1; 2 -2.2,0.5; 3 -2.2,0; 4 -2.2,-0.5; 5 -2.2,-1; 6 2.2,-1; 7 2.2,-0.5; 8 2.2,0; 9 2.2,0.5; 10 2.2,1

### Placement (x,y rotation side)
C1  49.28,19.94 0 top
C2  36.58,15.62 270 top
C3  11.18,20.07 90 top
C4  10.41,2.79 270 top
C5  14.99,21.59 180 top
C7  25.65,17.02 0 top
D1  4.83,21.08 90 top
D2  34.62,5.21 0 top
D3  14.73,3.56 270 top
F1  15.11,16.64 90 top
J1  48.44,11.05 90 top
J2  12.24,10.79 0 top
J3  47.88,1.78 0 bottom
J4  48.01,19.3 0 bottom
R1  8.38,20.57 0 top
R16  28.63,11.56 270 top
R17  29.39,14.61 180 top
R18  29.39,16.13 0 top
R19  32.44,16.13 0 top
R20  34.72,15.37 270 top
R21  32.44,14.61 180 top
R22  30.02,5.21 90 top
R23  27.99,5.21 90 top
R24  36.5,5.21 90 top
U1  13.72,0.89 90 bottom
U3  20.32,9.65 270 top
U4  32.44,9.53 90 top
U$1  [LOGO-BARE-750]  3.56,1.78 90 bottom

### Tracks (layer width: path | path; a pad name or v marks a point on that pad's centre or on a via)
24V_IN1
  Top 1.27: F1.1 15.11,10.24 J2.1
+3V3  (via drill 0.35)
  Top 0.305: v30.15,7.37 28.75,7.37 27.99,6.6 R23.2 | U4.1 30.19,7.33 v30.15,7.37 | R22.2 30.02,7.24 v30.15,7.37
  Top 0.559: C2.1 38.04,18.03 44.45,18.03 45.97,19.56 U1.24 | C1.1 U1.24 | U1.24 45.97,8.08 v45.64,7.75
  Bottom 0.305: v45.64,7.75 43.09,7.75 43.03,7.81 41.15,7.81 40.76,7.42 40.76,7.37 40.05,6.67 39.05,6.67 38.09,7.62 32.51,7.62 32.26,7.37 v30.15,7.37
+5V  (via drill 0.35)
  Top 0.305: v30.4,11.68 30.45,11.72 U4.10 | R19.2 33.21,17.13 32.94,17.4 v30.91,17.4 28.88,17.4 28.61,17.13 R18.1 27.81,16.13 27.18,15.49 24.7,15.49
  Top 0.559: U3.3 24.7,11.5 24.7,15.49 C7.1 | v44.63,10.41 44.63,5.41 45.97,4.06 U1.1
  Bottom 0.305: v44.63,10.41 44.56,10.48 41.59,10.48 40.38,11.68 v30.4,11.68 30.4,16.89 v30.91,17.4
+24V  (via drill 0.35)
  Top 0.305: 43.48,12.95 43.61,13.08 | 43.61,5.02 40.18,5.02 39.22,5.99 R24.2
  Top 0.559: 43.61,5.02 43.61,13.08 v43.61,17.02 | C5.1 15.84,19.23 15.49,18.89 | C3.1 9.84,19.12 9.16,19.8 R1.2
  Top 1.27: D3.1 12.62,5.41 10.41,7.62 | U3.1 20.32,12.95 15.49,17.78 15.49,18.89 15.26,19.12 | 15.26,19.12 F1.2 | 15.26,19.12 C3.1 11.18,13.46 10.41,12.7 10.41,7.62 | 10.41,7.62 C4.1
  Bottom 0.559: 38.21,16.05 38.21,14.94 39.55,13.61 J1.24V(6) | v43.61,17.02 39.18,17.02 38.21,16.05 | U3.1 26.42,18.29 36.32,18.29 38.21,16.4 38.21,16.05
DSCLM_1
  Top 0.305: 33.45,14.61 R21.1 33.31,14.57 33.44,14.45 U4.6 42.05,11.72 J1.DSCLM(5) | 33.45,14.61 34.71,14.61 R20.2 | 33.44,14.59 33.45,14.61
DSCLP_1
  Top 0.305: R19.1 R21.2 32.94,13.33 U4.7 32.94,10.55 33.07,10.41 J1.DSCLP(4)
DSDAM_1
  Top 0.305: R17.2 28.61,13.08 | 28.61,13.08 28.61,12.61 R16.1 | 28.61,13.08 31.42,13.08 31.94,12.56 U4.9 31.94,10.04 33.47,8.51 38.91,8.51 J1.DSDAM(2)
DSDAP_1
  Top 0.305: R17.1 R18.2 | 30.23,14.61 R17.1 | R17.1 30.17,14.08 30.5,13.75 31.52,13.75 32.44,12.83 U4.8 32.44,10.29 33.52,9.21 40.12,9.21 42.09,7.24 J1.DSDAP(1)
GND  (via drill 0.35)
  Top 0.305: 35.29,5.96 D2.C 33.79,5.96 33.44,6.32 U4.5 | v35.56,6.86 35.56,6.99
  Bottom 0.406: J1.GND(3) 35.36,9.14 35.23,9.27
  other vias: 42.6,15.88
  pour Top (isolate 0.406, rank 3): 0,0 54.61,0 54.61,22.86 0,22.86
  pour Bottom (isolate 0.406, rank 3): 0,0 54.61,0 54.61,22.86 0,22.86
N$5
  Top 0.305: R24.1 34.65,4.43 D2.A
N$6
  Top 0.305: D1.A 6.1,21.08 6.6,20.57 R1.1
SCL_IN
  Top 0.305: 31.32,9.78 32.94,8.16 U4.4 32.94,5.38 31.15,3.59 28.28,3.59 27.99,3.89 R23.1
SDA_IN
  Top 0.305: 31.17,9.02 31.94,8.25 U4.2 31.94,5.27 31.1,4.43 R22.1

### Text on the board
bPlace: Photon RJ45 v2.0